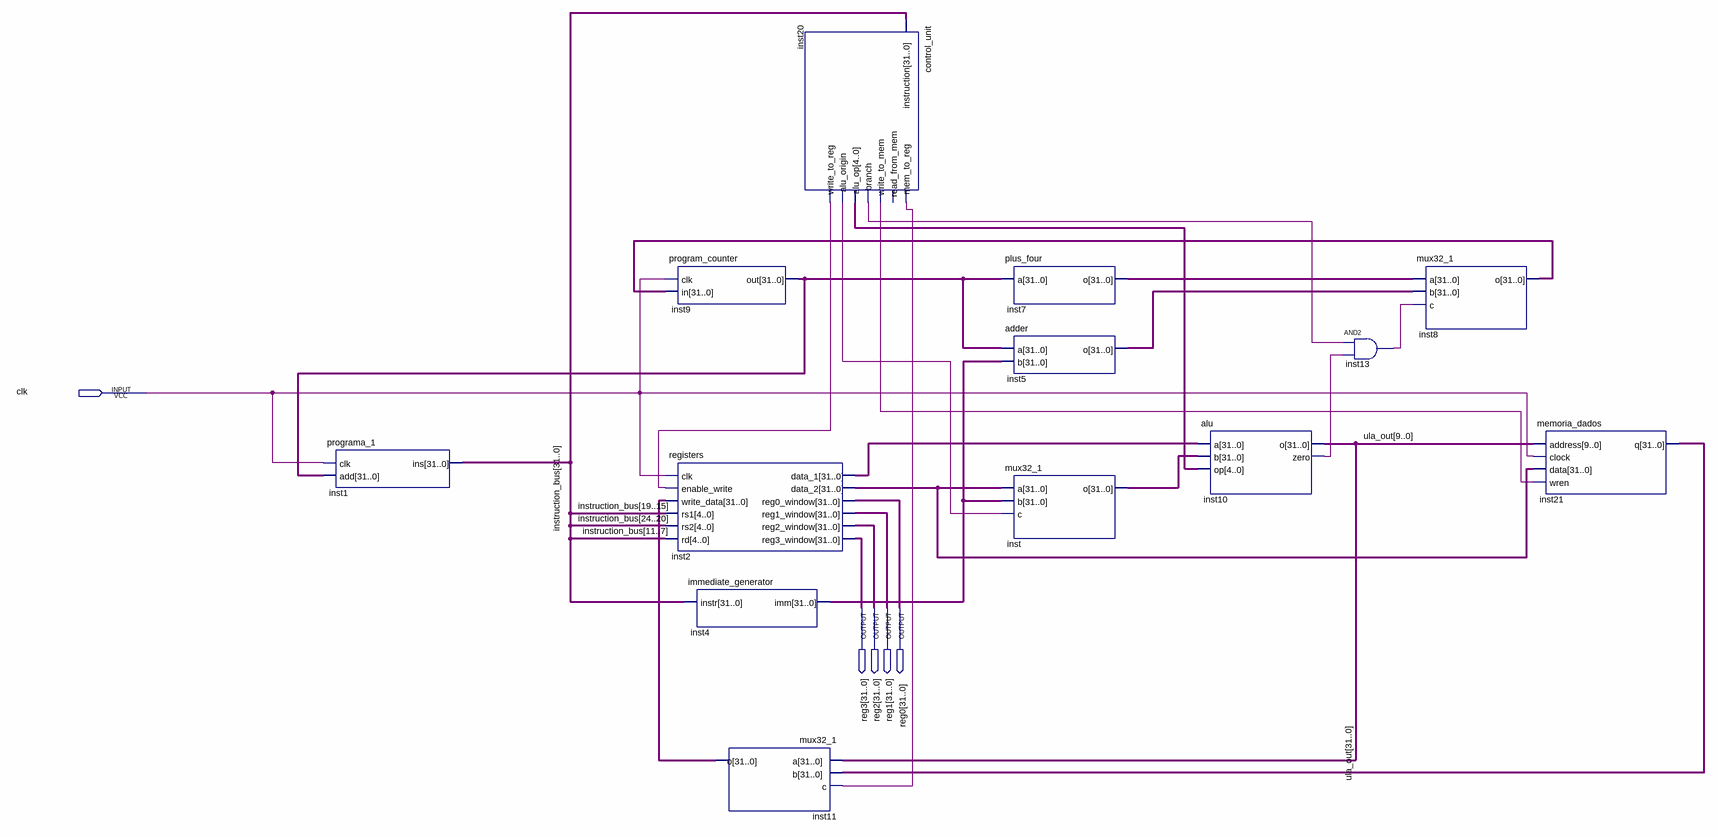
[diagram p0: schematic sheet]
// Quartus schematic processador.bdf as structural Verilog: 13 symbols, 5 pins
module processador (
  input  clk,
  output [31:0] reg3,
  output [31:0] reg2,
  output [31:0] reg1,
  output [31:0] reg0
);

  wire inst10_zero, inst13_out, inst20_alu_origin, inst20_branch, inst20_mem_to_reg, inst20_write_to_mem,
       inst20_write_to_reg;
  wire [4:0] inst20_alu_op;
  wire [31:0] inst2_data_1, inst2_data_2, inst4_imm, inst5_o, inst7_o, inst8_o, inst9_out, inst11_o,
       inst21_q, inst_o, instruction_bus, ula_out;

  programa_1 inst1 (.clk(clk), .add(inst9_out), .ins(instruction_bus));
  program_counter inst9 (.clk(clk), .in(inst8_o), .out(inst9_out));
  registers inst2 (
    .clk(clk), .enable_write(inst20_write_to_reg), .write_data(inst11_o), .rs1(instruction_bus[19:15]),
    .rs2(instruction_bus[24:20]), .rd(instruction_bus[11:7]), .data_1(inst2_data_1), .data_2(inst2_data_2),
    .reg0_window(reg0), .reg1_window(reg1), .reg2_window(reg2), .reg3_window(reg3));
  immediate_generator inst4 (.instr(instruction_bus), .imm(inst4_imm));
  mux32_1 inst11 (.a(ula_out), .b(inst21_q), .c(inst20_mem_to_reg), .o(inst11_o));
  control_unit inst20 (
    .instruction(instruction_bus), .mem_to_reg(inst20_mem_to_reg), .write_to_mem(inst20_write_to_mem),
    .branch(inst20_branch), .alu_op(inst20_alu_op), .alu_origin(inst20_alu_origin),
    .write_to_reg(inst20_write_to_reg));  // open: read_from_mem
  plus_four inst7 (.a(inst9_out), .o(inst7_o));
  adder inst5 (.a(inst9_out), .b(inst4_imm), .o(inst5_o));
  mux32_1 inst (.a(inst2_data_2), .b(inst4_imm), .c(inst20_alu_origin), .o(inst_o));
  alu inst10 (.a(inst2_data_1), .b(inst_o), .op(inst20_alu_op), .o(ula_out), .zero(inst10_zero));
  and inst13 (inst13_out, inst20_branch, inst10_zero);
  mux32_1 inst8 (.a(inst7_o), .b(inst5_o), .c(inst13_out), .o(inst8_o));
  memoria_dados inst21 (
    .address(ula_out[9:0]), .clock(clk), .data(inst2_data_2), .wren(inst20_write_to_mem), .q(inst21_q));
endmodule
